# Altium schematic sheet HYCW403-USBC16-785B1_HYCW403-USBC16-785B.schdoc
size 124 x 99 mm
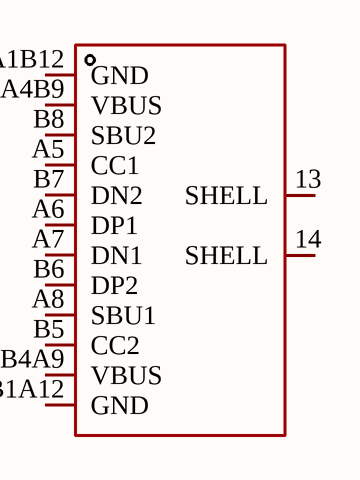
[diagram p0: HYCW403-USBC16-785B1_HYCW403-USBC16-785B.schdoc]

## Parts
USB?  HYCW403-USBC16-785B  [USB-C-SMD_HYCW403-USBC16-785B]  (value not drawn)

## Nets

Not connected (* = marked no-connect by the designer): USB? 13(SHELL) 14(SHELL) A1B12(GND) A4B9(VBUS) A5(CC1) A6(DP1) A7(DN1) A8(SBU1) B1A12(GND) B4A9(VBUS) B5(CC2) B6(DP2) B7(DN2) B8(SBU2)

## Library data of the parts
USB? = HYCW403-USBC16-785B: Manufacturer: 华宇创; Add into BOM: yes; Connector Type: Type-C; Protocol Standard: USB 3.1; Gender: Female; Number of Contacts: 16P; Number of Ports: 1; Current Rating-Power: 5A; Connect-Disconnect Life: 10,000 Cycles; Detection color: Black; Symbol: HYCW403-USBC16-785B; Device: HYCW403-USBC16-785B; LCSC Part Name: 两件套 防水Type-C 母 卧贴; Supplier Part: C5338271; Manufacturer Part: HYCW403-USBC16-785B; Supplier Footprint: SMD; JLCPCB Part Class: Extended Part; Datasheet: https://item.szlcsc.com/datasheet/HYCW403-USBC16-785B/6105655.html; Supplier: LCSC; Convert to PCB: yes; Mounting Type: Surface Mount, Right Angle; Voltage Rating: -; Supplementary Features: -; Length: 7.85mm; Operating Temperature: -30℃~+85℃